# Altium schematic sheet magChecker.SchDoc
size A
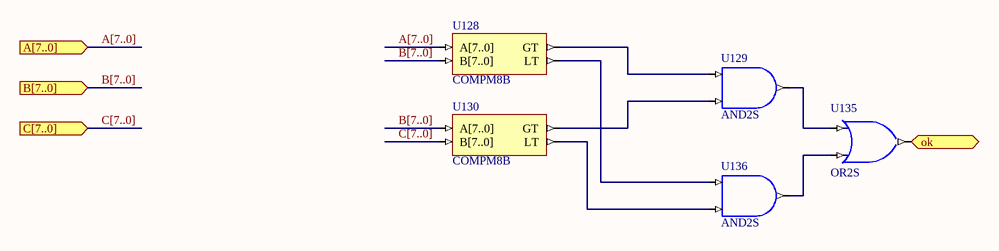
[diagram p0: magChecker.SchDoc]

## Parts
U128  COMPM8B
U129  AND2S
U130  COMPM8B
U135  OR2S
U136  AND2S

## Ports
A[7..0] (in), B[7..0] (in), C[7..0] (in), ok (out)

## Nets
A[7..0]: U128.A[7..0] ; port A[7..0]
B[7..0]: U128.B[7..0] U130.A[7..0] ; port B[7..0]
C[7..0]: U130.B[7..0] ; port C[7..0]
ok: U135.O ; port ok
NetU128_GT: U128.GT U129.I0
NetU128_LT: U128.LT U136.I0
NetU129_I1: U129.I1 U130.GT
NetU129_O: U129.O U135.I0
NetU130_LT: U130.LT U136.I1
NetU135_I1: U135.I1 U136.O

## Buses and harness runs
bus A[7..0]
bus A[7..0] = port A[7..0]
bus B[7..0]
bus B[7..0] = port B[7..0]
bus C[7..0]
bus C[7..0] = port C[7..0]

## Library data of the parts
U128 U130 = COMPM8B: 8-Bit Magnitude Comparator, Bus Version; XilinxEquivalent: COMPM8; SubClass: COMPM; PortSize: 8; ArchiveName: GENERIC; VHDLIB_SIM: GENERIC_LIB; Published: 29-Jan-2004; Publisher: Altium Limited; LastRevisionNo: 1.00.00; HelpURL: CR0118 FPGA Generic Library Guide.pdf#page=153; ComponentLink1URL: CR0129 FPGA Comparator Resource Usage.pdf#page=37; ComponentLink1Description: Core &Resource Usage; FunctionalClass: Comparator; PortStyle: Bus Version
U129 U136 = AND2: 2-Input AND Gate, Single Pin Version; XilinxEquivalent: AND2; FunctionalClass: Logic Primitive; PortSize: 2; ArchiveName: GENERIC; VHDLIB_SIM: GENERIC_LIB; Published: 29-Jan-2004; Publisher: Altium Limited; LastRevisionNo: 1.00.00; HelpURL: CR0118 FPGA Generic Library Guide.pdf#page=114; ComponentLink1URL: CR0136 FPGA Logic Primitive Resource Usage.pdf#page=13; ComponentLink1Description: Core &Resource Usage; SubClass: AND; PortStyle: Single Pin Version
U135 = OR2: 2-Input OR Gate, Single Pin Version; XilinxEquivalent: OR2; FunctionalClass: Logic Primitive; PortSize: 2; ArchiveName: GENERIC; VHDLIB_SIM: GENERIC_LIB; Published: 29-Jan-2004; Publisher: Altium Limited; LastRevisionNo: 1.00.00; HelpURL: CR0118 FPGA Generic Library Guide.pdf#page=410; ComponentLink1URL: CR0136 FPGA Logic Primitive Resource Usage.pdf#page=190; ComponentLink1Description: Core &Resource Usage; SubClass: OR; PortStyle: Single Pin Version